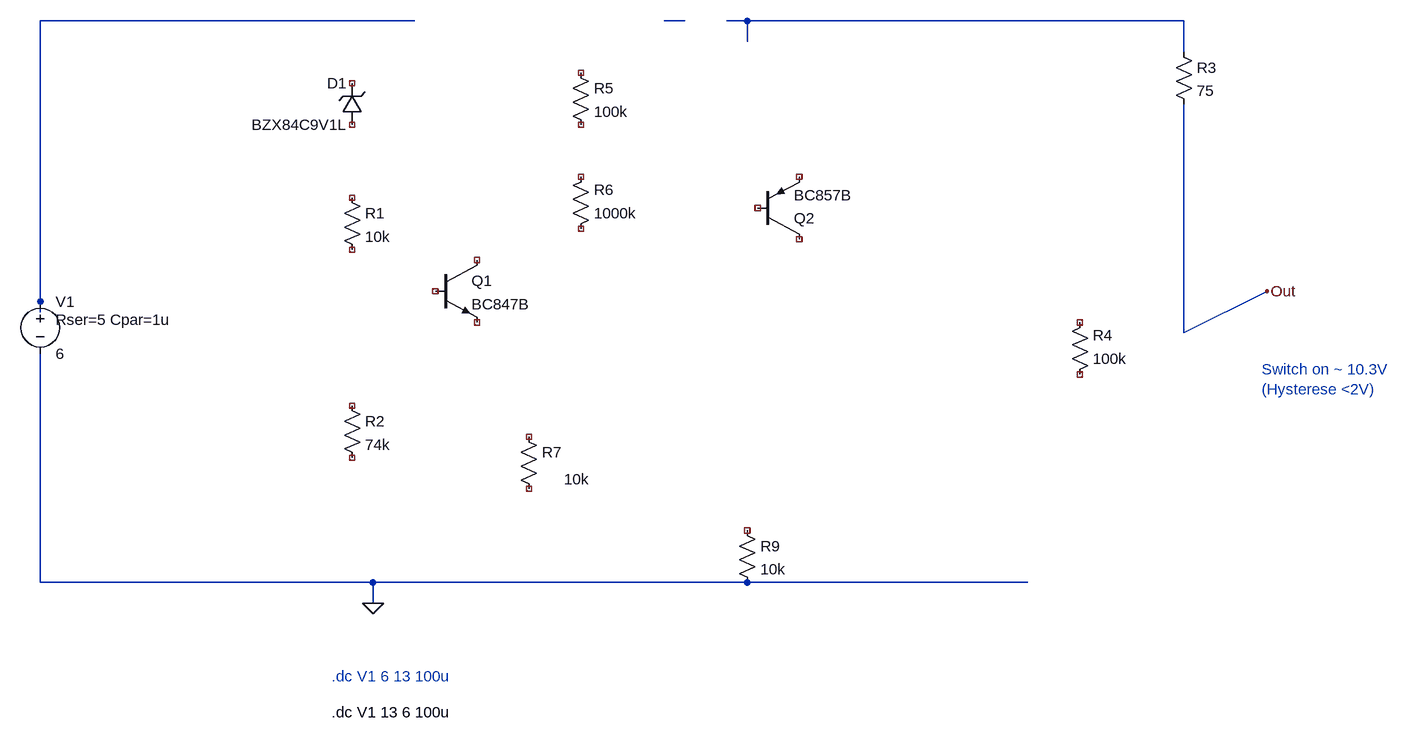
[diagram p0: schematic V0_SW03n.asc]
V0_SW03n.asc, the LTspice schematic file:
Version 4
SHEET 1 1680 696
WIRE 160 -384 -416 -384
WIRE 576 -384 544 -384
WIRE 672 -384 640 -384
WIRE 1344 -384 672 -384
WIRE 672 -352 672 -384
WIRE 1344 -336 1344 -384
WIRE -416 48 -416 -384
WIRE -416 64 -416 48
WIRE 1344 96 1344 -256
WIRE 1344 96 1472 32
WIRE -416 480 -416 128
WIRE 96 480 -416 480
WIRE 672 480 96 480
WIRE 1104 480 672 480
WIRE 96 512 96 480
FLAG 96 512 0
FLAG 1472 32 Out
SYMBOL res 48 -128 R0
SYMATTR InstName R1
SYMATTR Value 10k
SYMBOL res 48 192 R0
SYMATTR InstName R2
SYMATTR Value 74k
SYMBOL zener 80 -224 R180
WINDOW 0 24 64 Left 2
WINDOW 3 24 0 Left 2
SYMATTR InstName D1
SYMATTR Value BZX84C9V1L
SYMBOL res 1328 -352 R0
SYMATTR InstName R3
SYMATTR Value 75
SYMBOL voltage -416 32 R0
WINDOW 123 0 0 Left 0
WINDOW 39 24 44 Left 2
SYMATTR SpiceLine Rser=5 Cpar=1u
SYMATTR InstName V1
SYMATTR Value 6
SYMBOL res 400 -48 M180
WINDOW 0 36 76 Left 2
WINDOW 3 36 40 Left 2
SYMATTR InstName R6
SYMATTR Value 1000k
SYMBOL res 320 240 R0
WINDOW 3 70 81 Left 2
SYMATTR InstName R7
SYMATTR Value 10k
SYMBOL pnp 688 -48 M180
SYMATTR InstName Q2
SYMATTR Value BC857B
SYMBOL res 1168 176 M180
WINDOW 0 36 76 Left 2
WINDOW 3 36 40 Left 2
SYMATTR InstName R4
SYMATTR Value 100k
SYMBOL res 400 -320 R0
SYMATTR InstName R5
SYMATTR Value 100k
SYMBOL npn 192 -16 R0
SYMATTR InstName Q1
SYMATTR Value BC847B
SYMBOL res 656 384 R0
SYMATTR InstName R9
SYMATTR Value 10k
TEXT 32 624 Left 2 ;.dc V1 6 13 100u
TEXT 1464 152 Left 2 ;Switch on ~ 10.3V\n(Hysterese <2V)
TEXT 32 680 Left 2 !.dc V1 13 6 100u

The netlist it stands for:
* V0_SW03n.asc
R1 NC_01 NC_02 10k
R2 NC_03 NC_04 74k
D1 NC_05 NC_06 BZX84C9V1L
R3 N003 Out 75
V1 N001 0 6 Rser=5 Cpar=1u
R6 NC_07 NC_08 1000k
R7 NC_09 NC_10 10k
Q2 NC_11 NC_12 NC_13 0 BC857B
R4 NC_14 NC_15 100k
R5 NC_16 NC_17 100k
Q1 NC_18 NC_19 NC_20 0 BC847B
R9 NC_21 0 10k
.model D D
.lib standard.dio
.model NPN NPN
.model PNP PNP
.lib standard.bjt
* .dc V1 6 13 100u
* Switch on ~ 10.3V
* (Hysterese <2V)
.dc V1 13 6 100u
.backanno
.end